# EAGLE design SimpleBattCharger (EAGLE 6.5.0)
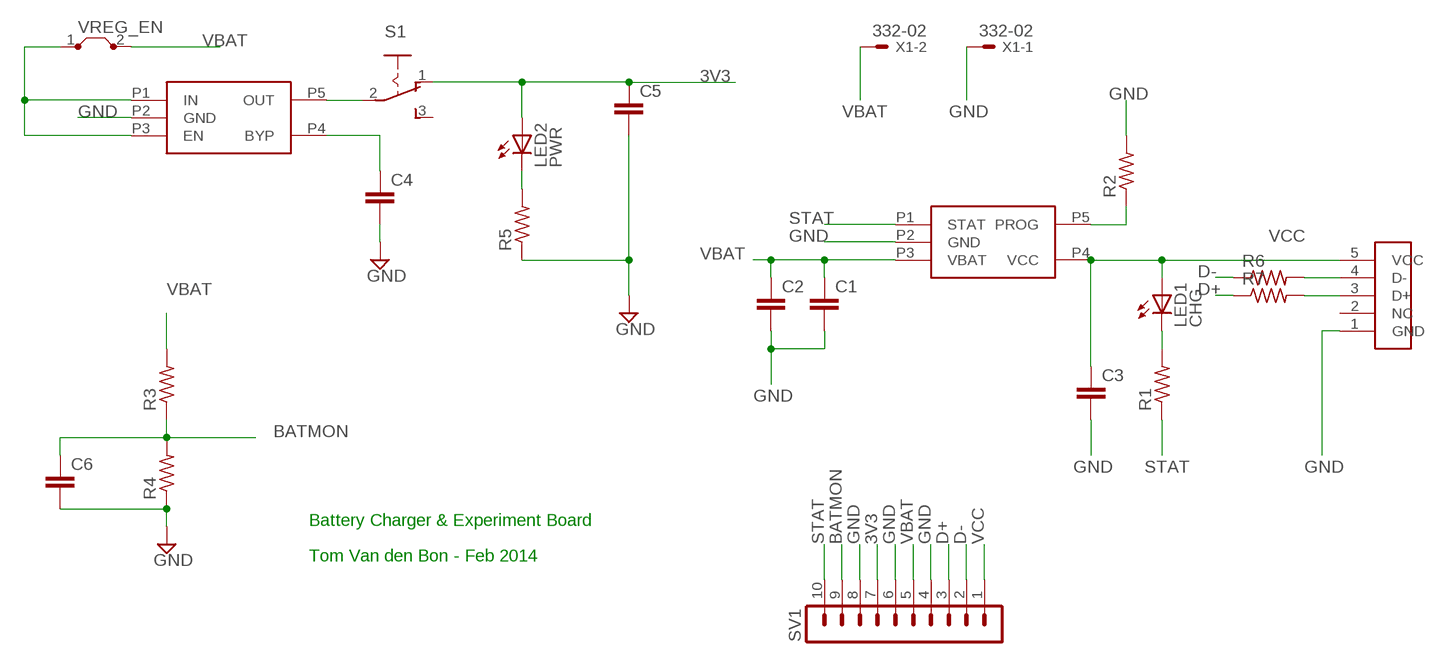
[diagram p0: schematic, sheet 1]

## Parts
C1  C-EUC0603K  [C0603K]
C2  C-EUC0603K  [C0603K]
C3  C-EUC0603K  [C0603K]
C4  C-EUC0603  [C0603]
C5  C-EUC3225  [C3225]
C6  C-EUC0603  [C0603]
LED1  CHG  LEDSML0603  [SML0603]
LED2  PWR  LEDSML0603  [SML0603]
R1  R-US_R0603  [R0603]
R2  R-US_R0603  [R0603]
R3  R-US_R0603  [R0603]
R4  R-US_R0603  [R0603]
R5  R-US_R0603  [R0603]
R6  R-US_R0603  [R0603]
R7  R-US_R0603  [R0603]
S1  255SB  [255SB]
SV1  MA10-1  [MA10-1]
U$1  USBSOCK_MINI_SMD  [USBSOCK_MINI_SMD]
U$2  MCP73831MCP73831T-2ACI/OT  [SOT-23-5]
U$3  MIC5219-X.XBM5MIC5219-3.3YM5TR  [SOT-23-5]
VREG_EN  J5MM  [05]
X1  332-02  [332-02]

## Nets
3V3: C5.1 LED2.A S1.1(O) SV1.7
BATMON: C6.1 R3.1 R4.2 SV1.9
D+: R7.1 SV1.3
D-: R6.1 SV1.2
GND: C1.2 C2.2 C3.2 C4.2 C5.2 C6.2 R2.2 R4.1 R5.1 SV1.4 SV1.6 SV1.8 U$1.1(GND) U$2.P2(GND) U$3.P2(GND) X1.1
N$1: R2.1 U$2.P5(PROG)
N$2: LED1.C R1.2
N$3: C4.1 U$3.P4(BYP)
N$4: U$3.P1(IN) U$3.P3(EN) VREG_EN.1
N$5: S1.2(P) U$3.P5(OUT)
N$6: LED2.C R5.2
N$7: R6.2 U$1.4(D-)
N$8: R7.2 U$1.3(D+)
STAT: R1.1 SV1.10 U$2.P1(STAT)
VBAT: C1.1 C2.1 R3.2 SV1.5 U$2.P3(VBAT) VREG_EN.2 X1.2
VCC: C3.1 LED1.A SV1.1 U$1.5(VCC) U$2.P4(VCC)
Unconnected: S1.3(S) U$1.2(NC)

## Notes on the sheet
- Battery Charger & Experiment Board
- Tom Van den Bon - Feb 2014

## Library data of the parts
C1-C6 = rcl:C-EU: CAPACITOR, European symbol
LED1 LED2 = led:LED: LED OSRAM: - CHIPLED LG R971, LG N971, LY N971, LG Q971, LY Q971, LO R971, LY R971 LH N974, LH R974 LS Q976, LO Q976, LY Q976 LO Q996 - Hyper CHIPLED LW Q18S LB Q993, LB Q99A, LB R99A - SideLED LS A670, LO A670, LY A670, LG A670, LP A670 LB A673, LV A673, LT A673, LW A673 LH A674 LY A675 LS A676, LA A676, LO A676, LY A676, LW A676 LS A679, LY A679, LG A679 - Hyper Micro SIDELED® LS Y876, LA Y876, LO Y876, LY Y876 LT Y87S - SmartLED LW L88C, LW L88S LB L89C, LB L89S, LG L890 LS L89K, LO L89K, LY L89K LS L896, LA L896, LO L896, LY L896 - TOPLED LS T670, LO T670, LY T670, LG T670, LP T670 LSG T670, LSP T670, LSY T670, LOP T670, LYG T670 LG T671, LOG T671, LSG T671 LB T673, LV T673, LT T673, LW T673 LH T674 LS T676, LA T676, LO T676, LY T676, LB T676, LH T676, LSB T676, LW T676 LB T67C, LV T67C, LT T67C, LS T67K, LO T67K, LY T67K, LW E67C LS E67B, LA E67B, LO E67B, LY E67B, LB E67C, LV E67C, LT E67C LW T67C LS T679, LY T679, LG T679 LS T770, LO T770, LY T770, LG T770, LP T770 LB T773, LV T773, LT T773, LW T773 LH T774 LS E675, LA E675, LY E675, LS T675 LS T776, LA T776, LO T776, LY T776, LB T776 LHGB T686 LT T68C, LB T68C - Hyper Mini TOPLED® LB M676 - Mini TOPLED Santana® LG M470 LS M47K, LO M47K, LY M47K Source: http://www.osram.convergy.de LUXEON: - LUMILED® LXK2-PW12-R00, LXK2-PW12-S00, LXK2-PW14-U00, LXK2-PW14-V00 LXK2-PM12-R00, LXK2-PM12-S00, LXK2-PM14-U00 LXK2-PE12-Q00, LXK2-PE12-R00, LXK2-PE12-S00, LXK2-PE14-T00, LXK2-PE14-U00 LXK2-PB12-K00, LXK2-PB12-L00, LXK2-PB12-M00, LXK2-PB14-N00, LXK2-PB14-P00, LXK2-PB14-Q00 LXK2-PR12-L00, LXK2-PR12-M00, LXK2-PR14-Q00, LXK2-PR14-R00 LXK2-PD12-Q00, LXK2-PD12-R00, LXK2-PD12-S00 LXK2-PH12-R00, LXK2-PH12-S00 LXK2-PL12-P00, LXK2-PL12-Q00, LXK2-PL12-R00 Source: www.luxeon.com KINGBRIGHT: KA-3528ASYC Source: www.kingbright.com
R1 R2 R5-R7 = resistor:R-US_: RESISTOR, American symbol
R3 R4 = rcl:R-US_: RESISTOR, American symbol
S1 = switch:255SB: SLIDING SWITCH Distributor Buerklin, 11G810
SV1 = con-lstb:MA10-1: PIN HEADER; OC_FARNELL: unknown; OC_NEWARK: unknown
U$1 = protofactory:USBSOCK_MINI_SMD
U$2 = protofactory:MCP73831: Miniature Single-Cell, Fully Integrated Li-Ion, Li-Polymer Charge Management Controllers
U$3 = protofactory:MIC5219-X.XBM5: 3.3V LDO
VREG_EN = jumper:J: Bridge
X1 = con-garry:332-02: 2 Pin - 2mm Dual Row Source: www.mpe-connector.de / garry_shortform_2012.pdf

## Board
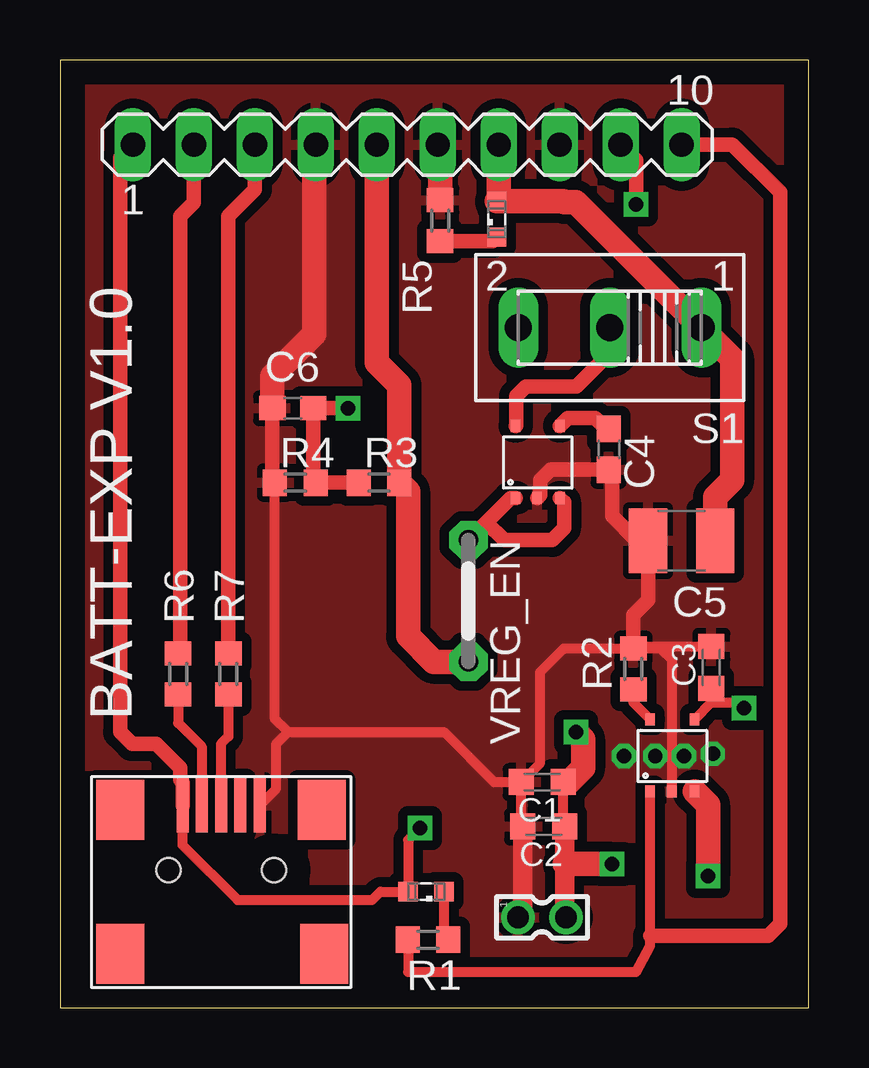
[diagram p1: board, top side]
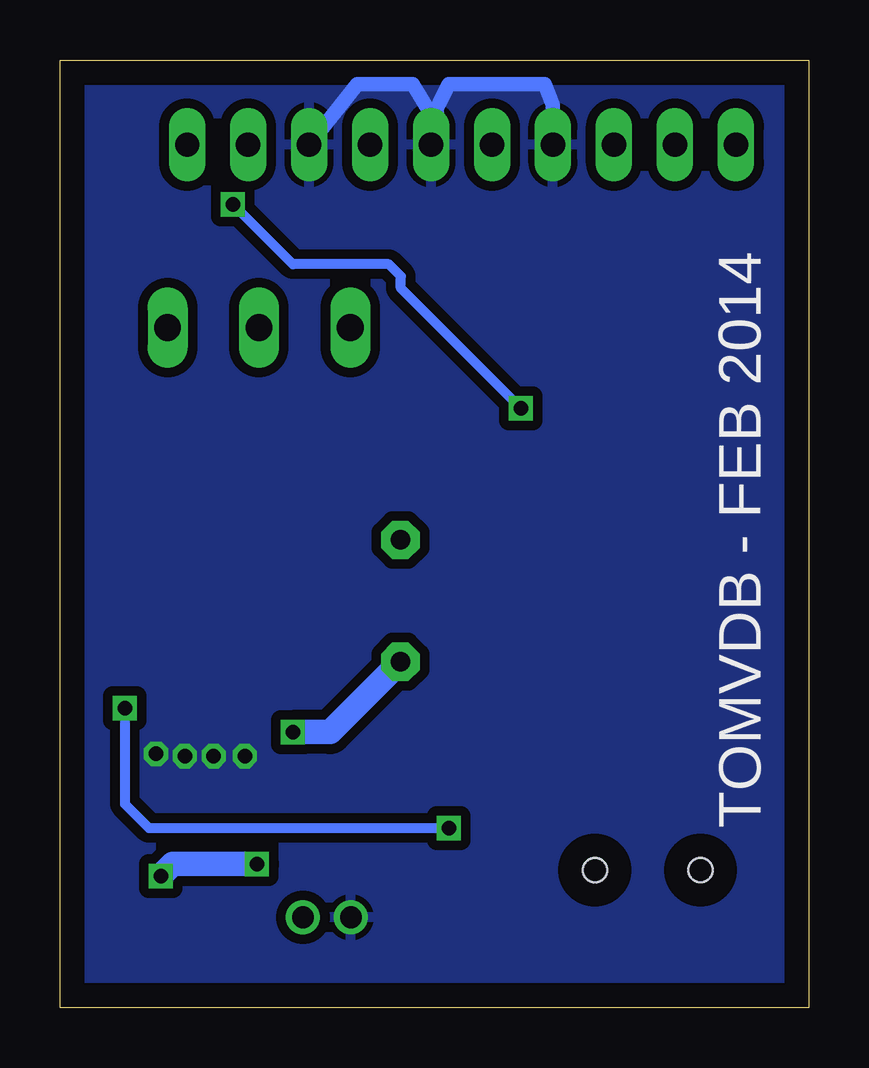
[diagram p2: board, bottom side, seen from below]

Size 31.2 x 39.52 mm. Coordinates in mm from the lower left corner, seen from the top.
Outline: 0,0 31.2,0 31.2,39.52 0,39.52 0,0
Copper layers (1*16): Top 0.035mm / dielectric 1.5mm / Bottom 0.035mm
Design rules "default": minimum track width 10mil, minimum drill 24mil, track to track 8mil, track to pad 8mil, pad to pad 8mil, via to via 8mil, smd to smd 8mil, copper to edge 40mil, drill to drill 8mil, minimum pad ring 10mil, minimum via ring 8mil, stop-mask expansion 4mil, vias tented up to drill 0mil, thermal gap 10mil

### Footprints (pad centres in the part's own frame; a part is rotated, then mirrored left to right if it is on the bottom)
C0603K = smd 1.05 x 1.08: 1 -0.875,0; 2 0.875,0
C0603 = smd 1.1 x 1: 1 -0.85,0; 2 0.85,0
C3225 = smd 1.6 x 2.7: 1 -1.4,0; 2 1.4,0
SML0603 = smd 0.8 x 0.8: A 0.75,0; C -0.75,0
R0603 = smd 1 x 1.1: 1 -0.85,0; 2 0.85,0
255SB = drill 1.118 long: 1 -3.81,0; 2 0,0; 3 3.81,0
MA10-1 = drill 1.016 long: 1 -11.43,0; 2 -8.89,0; 3 -6.35,0; 4 -3.81,0; 5 -1.27,0; 6 1.27,0; 7 3.81,0; 8 6.35,0; 9 8.89,0; 10 11.43,0
USBSOCK_MINI_SMD = smd 0.5 x 2.25: 1 1.6,1.6; 2 0.8,1.6; 3 0,1.6; 4 -0.8,1.6; 5 -1.6,1.6 | smd 2 x 2.5: P$6 -4.2,1.4; P$7 4.2,1.4; P$8 -4.2,-4.6; P$9 4.3,-4.6 | hole 1: 2.2,-1.1; -2.2,-1.1
SOT-23-5 = smd 0.4 x 0.5: P1 0.2,0.25; P2 1.1,0.25; P3 2.05,0.25; P4 2.05,3.25; P5 0.2,3.25
05 = drill 0.813 pad 1.6 octagon: 1 -2.54,0; 2 2.54,0
332-02 = drill 0.9 pad 1.27: 1 0,-1; 2 0,1

### Placement (x,y rotation side)
C1  20.09,9.42 180 top
C2  20.16,7.57 180 top
C3  27.14,14.2 90 top
C4  22.86,23.29 270 top
C5  25.9,19.48 180 top
C6  9.7,25 180 top
LED1  15.25,4.85 180 top
LED2  18.2,32.88 90 top
R1  15.33,2.85 0 top
R2  23.89,14.13 90 top
R3  13.29,21.9 0 top
R4  9.8,21.9 0 top
R5  15.84,32.82 270 top
R6  4.92,13.93 270 top
R7  7.01,13.93 270 top
S1  22.91,28.36 180 top
SV1  14.47,35.99 0 top
U$1  6.71,6.85 0 top
U$2  24.39,8.78 0 top
U$3  18.78,21.02 0 top
VREG_EN  17.02,16.97 270 top
X1  20.08,3.78 270 top

### Tracks (layer width: path | path; a pad name or v marks a point on that pad's centre or on a via)
3V3
  Top 1.016: C5.1 27.3,21.3 28,22 28,27.08 S1.1 21.48,33.6 21,33.6 20.97,33.63 LED2.A 18.28,33.71 SV1.7
BATMON  (via drill 0.6)
  Top 0.61: R3.1 R4.2 10.55,22 C6.1 v11.99,25 v12,25 | SV1.9 24,35.35 v24,33.5
  Bottom 0.406: v12,25 17,30 17,30.5 17.5,31 21.5,31 v24,33.5
D+
  Top 0.61: R7.1 7,14.79 7,33 8.12,34.12 SV1.3
D-
  Top 0.406: 5.6,35.97 SV1.2
  Top 0.61: R6.1 5,14.86 5,33 5.58,33.58 SV1.2
GND  (via drill 0.6)
  Top 0.406: U$1.1 9,9.13 9,11 9.5,11.5 | 9.5,11.5 16,11.5 18.08,9.42 C1.2 | C2.2 19.21,7.64 C1.2 | U$2.P2 25.5,14.5 25.02,14.98 R2.2 | R2.2 23.98,15.07 C3.2 | C1.2 20,10.21 20,14 20.98,14.98 R2.2 | 9.5,11.5 8.95,12.05 R4.1
  Top 0.61: SV1.4 10.34,35.67 | R4.1 8.85,22 C6.2 | U$3.P2 20,21.39 20,22 20.44,22.44 C4.2 23,22.3 23,20.5 24.02,19.48 C5.2 24.5,17 23.89,16.39 R2.2
  Top 0.813: X1.1 19.29,3.78 C2.2
  Top 1.016: SV1.4 10.6,35.93 10.6,28.1 8.85,26.35 C6.2 | SV1.6 15.84,35.89 R5.1
  Bottom 0.61: SV1.8 18.81,38.5 16.5,38.5 15.74,37.24 SV1.6 15.5,36.23 15.5,37.5 15,38.5 11,38.5 10.66,37.66 SV1.4
  other vias: 23.5,10.5 24.8,10.5 26,10.5 27.2,10.6
  pour Top (isolate 0.406, rank 4): -1,40.5 -1,0 32.5,0 32.5,40.5
  pour Bottom (isolate 0.406, rank 4): -0.5,40 -0.5,0 32,0 32,40 31.5,40
N$1
  Top 0.406: U$2.P5 23.89,12.73 R2.1
N$2
  Top 0.406: R1.2 16,3.03 LED1.C
N$3
  Top 0.61: U$3.P4 21.16,24.6 22.3,24.6 22.76,24.14 C4.1
N$4
  Top 0.61: VREG_EN.1 17.75,20.25 | 17.75,20.25 18.78,21.27 U$3.P1 | U$3.P3 21,21.1 21,20 20.5,19.5 18.5,19.5 17.75,20.25
N$5
  Top 0.61: U$3.P5 19,24.29 19,25.5 19.4,25.9 21.5,25.9 22.91,27.31 S1.2
N$6
  Top 0.61: LED2.C 18.04,31.97 R5.2
N$7
  Top 0.406: R6.2 4.92,11.88 5.9,10.9 5.9,8.46 U$1.4
N$8
  Top 0.406: R7.2 7.01,11.31 6.7,11 6.7,8.46 U$1.3
STAT
  Top 0.406: R1.1 14.5,2.83 14.5,1.5 24,1.5 24.59,2.59 24.59,3 U$2.P1
  Top 0.61: SV1.10 28.01,35.99 30,34 30,3.5 29.5,3 24.59,3
VBAT  (via drill 0.6)
  Top 0.406: C2.1 21,7.54 21,7.5 20.96,7.54 C1.1
  Top 0.813: X1.2 21.04,3.78 21.04,6 C2.1
  Top 1.016: U$2.P3 27,8.47 v27,5.5 | v23,6 21.04,6 | SV1.5 13.2,26.9 14.14,25.96 R3.2 14.5,21.54 14.5,15.5 15.57,14.43 VREG_EN.2 | v21.5,11.5 21.8,11.2 21.8,10 21.22,9.42 C1.1
  Bottom 1.016: v27,5.5 26.5,6 v23,6 | VREG_EN.2 19.95,11.5 v21.5,11.5
VCC  (via drill 0.6)
  Top 0.406: 27.14,12.73 C3.1 | U$1.5 5.1,8.43 5.1,6.8 7.4,4.5 13,4.5 13.35,4.85 LED1.A 14.5,7 v15,7.5 | 27.14,12.73 28.5,12.73 v28.5,12.5 | 27.14,12.73 U$2.P4
  Top 0.61: SV1.1 2.5,35.45 2.5,11.5 3,11 4,11 5,10 5,9.5 5.12,9.38 U$1.5
  Bottom 0.406: v28.5,12.5 28.5,8.5 27.5,7.5 v15,7.5

### Text on the board
tNames: BATT-EXP V1.0
bNames: TOMVDB - FEB 2014